# Altium project XbeeReceiver.PrjPcb
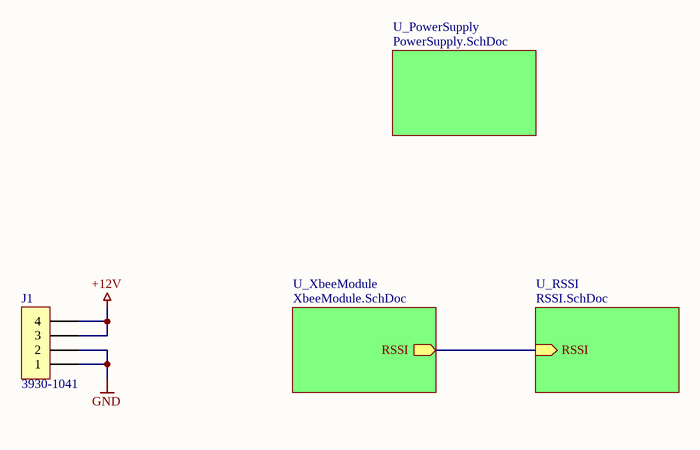
[diagram p0: Main.SchDoc]
4 sheets, 49 parts. Net scope: hierarchical (ports join the sheet entries above them; power ports are global).
Board file: XBeeReceiver.PcbDoc
Sheets:
  Main.SchDoc
    U_PowerSupply = PowerSupply.SchDoc
    U_RSSI = RSSI.SchDoc
    U_XbeeModule = XbeeModule.SchDoc

## Sheet Main.SchDoc
size A

### Parts
J1  3930-1041  [MOLEX-3930-1041]

### Sub-sheets
U_PowerSupply = PowerSupply.SchDoc: no entries
U_RSSI = RSSI.SchDoc: RSSI (in)
U_XbeeModule = XbeeModule.SchDoc: RSSI (out)

### Nets
+12V: J1.3 J1.4
GND: J1.1 J1.2
NetM1_7: sheet U_RSSI/RSSI, sheet U_XbeeModule/RSSI

### Library data of the parts
J1 = Molex-MiniFit-4-RA: Molex MiniFit, Dual Row, Right Angle 3930-1041; Supplier 1: Mouser; Supplier Part Number 1: 538-39-30-1041

## Sheet PowerSupply.SchDoc
size A4
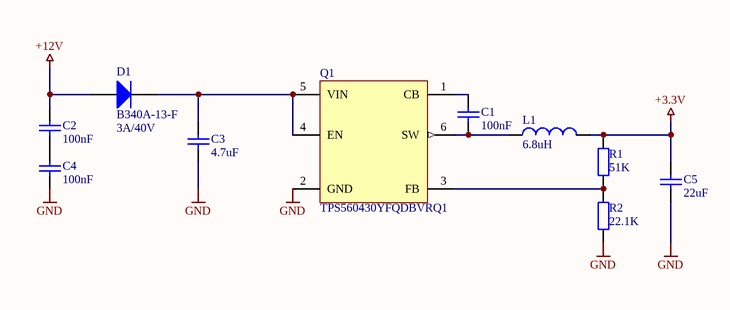
[diagram p1: PowerSupply.SchDoc]

### Parts
C1  value 100nF  [CAPC1608X08N]  (hidden comment: CGA3E2X7R1H104K080AA)
C2  value 100nF  [CAPC1608X08N]  (hidden comment: CGA3E2X7R1H104K080AA)
C3  value 4.7uF  [CAPC2012X14N]  (hidden comment: CGA4J3X5R1H475K125AB)
C4  value 100nF  [CAPC1608X08N]  (hidden comment: CGA3E2X7R1H104K080AA)
C5  value 22uF  [CAPC3225X28N]  (hidden comment: CGA6P1X7R1C226M250AC)
D1  B340A-13-F  value 3A/40V  [DIOM4326X24N]
L1  value 6.8uH  [INDP3532X20N]  (hidden comment: SRP3020TA-6R8M)
Q1  TPS560430YFQDBVRQ1  [SOT95P280X110-6N]
R1  value 51K  [RESC1608X04N]  (hidden comment: ERJ-3EKF5102V)
R2  value 22.1K  [RESC1608X04N]  (hidden comment: ERJ-3EKF2212V)

### Nets
+3.3V: C5.2 L1.2 R1.2
+12V: C2.2 D1.1(A)
GND: C3.1 C4.1 C5.1 Q1.2(GND) R2.1
NetC1_1: C1.1 L1.1 Q1.6(SW)
NetC1_2: C1.2 Q1.1(CB)
NetC2_1: C2.1 C4.2
NetC3_2: C3.2 D1.2(K) Q1.4(EN) Q1.5(VIN)
NetQ1_3: Q1.3(FB) R1.1 R2.2

### Library data of the parts
C1 C2 C4 = C0603-100nF-50V: 0603 Capacitor, 100nF; Supplier 1: Mouser; Supplier Part Number 1: 810-CGA3E2X7R1H104K
C3 = C0805-4.7uF-50V: 0805 Capacitor, 4.7uF; Supplier 1: Mouser; Supplier Part Number 1: 810-CGA4J3X5R1H475K
C5 = C1210-22uF-16V: 1210 Capacitor, 22uF; Supplier 1: Mouser; Supplier Part Number 1: 810-CGA6P1X7R1C226M
D1 = D-SCH-3A-40V: Schottky Diode, 3A, 40A; Supplier 1: Mouser; Supplier Part Number 1: 621-B340A-F
L1 = IND-6.8uH-1.9A: Inductor 6.8uH, 1.9A, 2.2A Isat; Supplier 1: Mouser; Supplier Part Number 1: 652-SRP3020TA-6R8M
Q1 = TPS560430YF: TPS560430-Q1 SIMPLE SWITCHER 4-V to 36-V, 600-mA Synchronous Buck Converter; Supplier 1: Mouser; Supplier Part Number 1: 595-S560430YFQDBVRQ1
R1 = R0603R51K: 0603 Resistor; Supplier 1: Mouser; Supplier Part Number 1: 667-ERJ-3EKF5102V
R2 = R0603R22.1K: 0603 Resistor; Supplier 1: Mouser; Supplier Part Number 1: 667-ERJ-3EKF2212V

## Sheet RSSI.SchDoc
size A4
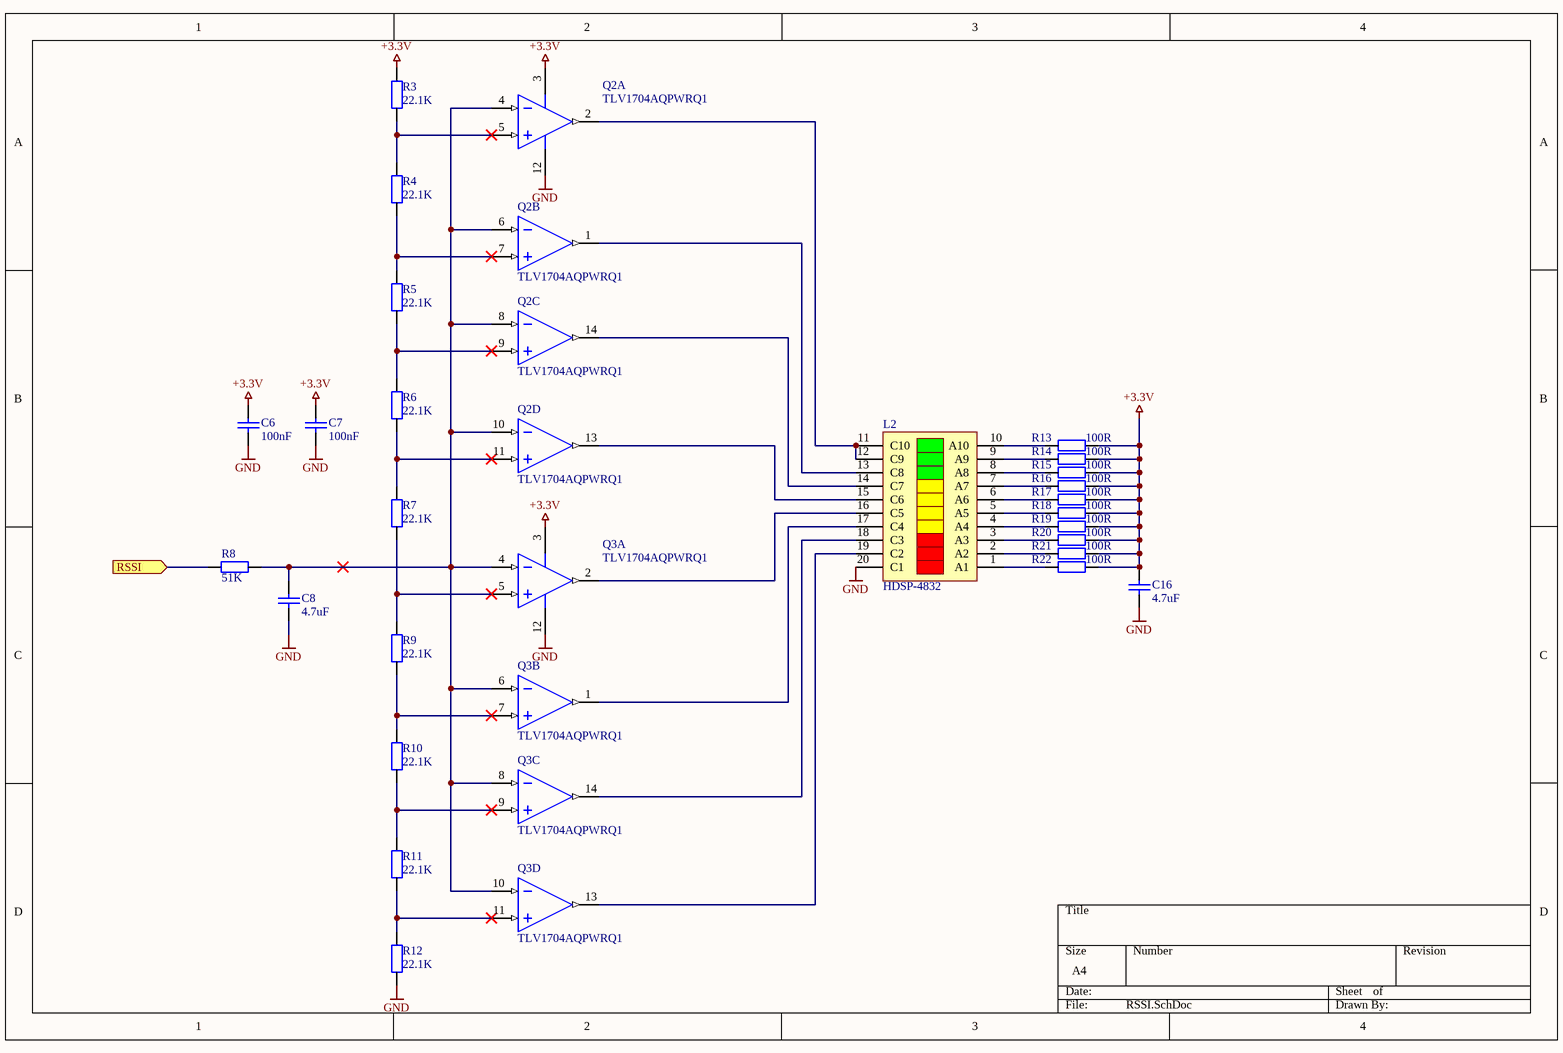
[diagram p2: RSSI.SchDoc]

### Parts
C6  value 100nF  [CAPC1608X08N]  (hidden comment: CGA3E2X7R1H104K080AA)
C7  value 100nF  [CAPC1608X08N]  (hidden comment: CGA3E2X7R1H104K080AA)
C8  value 4.7uF  [CAPC2012X14N]  (hidden comment: CGA4J3X5R1H475K125AB)
C16  value 4.7uF  [CAPC2012X14N]  (hidden comment: CGA4J3X5R1H475K125AB)
L2  HDSP-4832  [HDSP-4832]
Q2  TLV1704AQPWRQ1  [TSOP65P640X120-14N]  (parts A,B,C,D of 4)
Q3  TLV1704AQPWRQ1  [TSOP65P640X120-14N]  (parts A,B,C,D of 4)
R3  value 22.1K  [RESC1608X04N]  (hidden comment: ERJ-3EKF2212V)
R4  value 22.1K  [RESC1608X04N]  (hidden comment: ERJ-3EKF2212V)
R5  value 22.1K  [RESC1608X04N]  (hidden comment: ERJ-3EKF2212V)
R6  value 22.1K  [RESC1608X04N]  (hidden comment: ERJ-3EKF2212V)
R7  value 22.1K  [RESC1608X04N]  (hidden comment: ERJ-3EKF2212V)
R8  value 51K  [RESC1608X04N]  (hidden comment: ERJ-3EKF5102V)
R9  value 22.1K  [RESC1608X04N]  (hidden comment: ERJ-3EKF2212V)
R10  value 22.1K  [RESC1608X04N]  (hidden comment: ERJ-3EKF2212V)
R11  value 22.1K  [RESC1608X04N]  (hidden comment: ERJ-3EKF2212V)
R12  value 22.1K  [RESC1608X04N]  (hidden comment: ERJ-3EKF2212V)
R13  value 100R  [RESC1608X04N]  (hidden comment: ERJ-3EKF1000V)
R14  value 100R  [RESC1608X04N]  (hidden comment: ERJ-3EKF1000V)
R15  value 100R  [RESC1608X04N]  (hidden comment: ERJ-3EKF1000V)
R16  value 100R  [RESC1608X04N]  (hidden comment: ERJ-3EKF1000V)
R17  value 100R  [RESC1608X04N]  (hidden comment: ERJ-3EKF1000V)
R18  value 100R  [RESC1608X04N]  (hidden comment: ERJ-3EKF1000V)
R19  value 100R  [RESC1608X04N]  (hidden comment: ERJ-3EKF1000V)
R20  value 100R  [RESC1608X04N]  (hidden comment: ERJ-3EKF1000V)
R21  value 100R  [RESC1608X04N]  (hidden comment: ERJ-3EKF1000V)
R22  value 100R  [RESC1608X04N]  (hidden comment: ERJ-3EKF1000V)

### Ports
RSSI (in)

### Nets
+3.3V: C6.2 C7.2 C16.2 Q2.3(V+) Q3.3(V+) R3.2 R13.2 R14.2 R15.2 R16.2 R17.2 R18.2 R19.2 R20.2 R21.2 R22.2
GND: C6.1 C7.1 C8.1 C16.1 L2.20(C1) Q2.12(V-) Q3.12(V-) R12.1
NetC8_2: C8.2 Q2.4(IN1-) Q2.6(IN2-) Q2.8(IN3-) Q2.10(IN4-) Q3.4(IN1-) Q3.6(IN2-) Q3.8(IN3-) Q3.10(IN4-) R8.1
NetL2_1: L2.1(A1) R22.1
NetL2_2: L2.2(A2) R21.1
NetL2_3: L2.3(A3) R20.1
NetL2_4: L2.4(A4) R19.1
NetL2_5: L2.5(A5) R18.1
NetL2_6: L2.6(A6) R17.1
NetL2_7: L2.7(A7) R16.1
NetL2_8: L2.8(A8) R15.1
NetL2_9: L2.9(A9) R14.1
NetL2_10: L2.10(A10) R13.1
NetL2_11: L2.11(C10) L2.12(C9) Q2.2(OUT1)
NetL2_13: L2.13(C8) Q2.1(OUT2)
NetL2_14: L2.14(C7) Q2.14(OUT3)
NetL2_15: L2.15(C6) Q2.13(OUT4)
NetL2_16: L2.16(C5) Q3.2(OUT1)
NetL2_17: L2.17(C4) Q3.1(OUT2)
NetL2_18: L2.18(C3) Q3.14(OUT3)
NetL2_19: L2.19(C2) Q3.13(OUT4)
NetM1_7: R8.2 ; port RSSI
NetQ2_5: Q2.5(IN1+) R3.1 R4.2
NetQ2_7: Q2.7(IN2+) R4.1 R5.2
NetQ2_9: Q2.9(IN3+) R5.1 R6.2
NetQ2_11: Q2.11(IN4+) R6.1 R7.2
NetQ3_5: Q3.5(IN1+) R7.1 R9.2
NetQ3_7: Q3.7(IN2+) R9.1 R10.2
NetQ3_9: Q3.9(IN3+) R10.1 R11.2
NetQ3_11: Q3.11(IN4+) R11.1 R12.2

### Library data of the parts
C6 C7 = C0603-100nF-50V: 0603 Capacitor, 100nF; Supplier 1: Mouser; Supplier Part Number 1: 810-CGA3E2X7R1H104K
C8 C16 = C0805-4.7uF-50V: 0805 Capacitor, 4.7uF; Supplier 1: Mouser; Supplier Part Number 1: 810-CGA4J3X5R1H475K
L2 = HDSP-4832: 10-Element Bar Graph Array, Red Yellow Green; Supplier 1: Mouser; Supplier Part Number 1: 630-HDSP-4832
Q2 Q3 = TLV1704Q: TLV1704-Q1 2.2-V to 36-V, microPower Comparator, 4 channels; Published: 8-Jun-2000; LatestRevisionDate: 17-Jul-2002; LatestRevisionNote: Re-released for DXP Platform.; DatasheetVersion: REV. B; PackageVersion: 1990; PackageReference: H-08A; Publisher: Altium Limited; PackageDescription: Can; 8 Leads; Pin Circle Dia. 5.08 mm; Lead Dia. 0.53 mm (max); ComponentLink1Description: Manufacturer Link; ComponentLink1URL: http://www.analog.com/; Supplier 1: Mouser; Supplier Part Number 1: 595-TLV1704AQPWRQ1
R3-R7 R9-R12 = R0603R22.1K: 0603 Resistor; Supplier 1: Mouser; Supplier Part Number 1: 667-ERJ-3EKF2212V
R8 = R0603R51K: 0603 Resistor; Supplier 1: Mouser; Supplier Part Number 1: 667-ERJ-3EKF5102V
R13-R22 = R0603R100: 0603 Resistor; Supplier 1: Mouser; Supplier Part Number 1: 667-ERJ-3EKF1000V

## Sheet XbeeModule.SchDoc
size A4
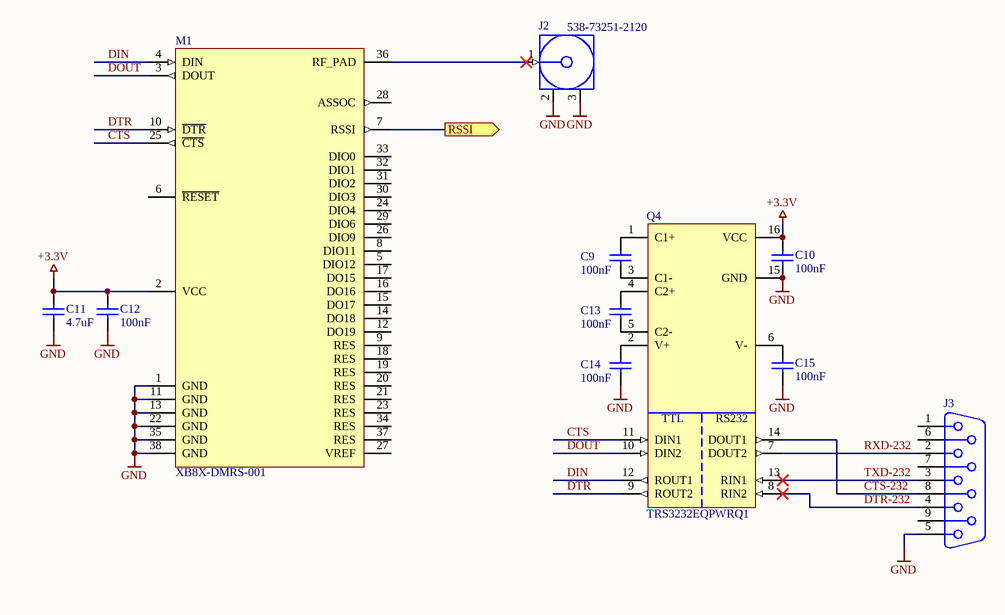
[diagram p3: XbeeModule.SchDoc]

### Parts
C9  value 100nF  [CAPC1608X08N]  (hidden comment: CGA3E2X7R1H104K080AA)
C10  value 100nF  [CAPC1608X08N]  (hidden comment: CGA3E2X7R1H104K080AA)
C11  value 4.7uF  [CAPC2012X14N]  (hidden comment: CGA4J3X5R1H475K125AB)
C12  value 100nF  [CAPC1608X08N]  (hidden comment: CGA3E2X7R1H104K080AA)
C13  value 100nF  [CAPC1608X08N]  (hidden comment: CGA3E2X7R1H104K080AA)
C14  value 100nF  [CAPC1608X08N]  (hidden comment: CGA3E2X7R1H104K080AA)
C15  value 100nF  [CAPC1608X08N]  (hidden comment: CGA3E2X7R1H104K080AA)
J2  Supplier Part Number 1: 538-73251-2120  [MOLEX-SMA-PCB]  (hidden comment: 73251-2120)
J3  DB9 - 2311765-2  [DB9F-PCB-TH]  (value not drawn)
M1  XB8X-DMRS-001  [XBEESX868MOD]
Q4  TRS3232EQPWRQ1  [TSOP65P640X120-16N]

### Ports
RSSI (out)

### Nets
+3.3V: C10.1 C11.2 C12.1 M1.2(VCC) Q4.16(VCC)
GND: C10.2 C11.1 C12.2 C14.2 C15.2 J2.2(GND) J2.3(GND) J3.5 M1.1(GND) M1.11(GND) M1.13(GND) M1.22(GND) M1.35(GND) M1.38(GND) Q4.15(GND)
CTS: M1.25(~{CTS}) Q4.11(DIN1)
CTS-232: J3.8 Q4.14(DOUT1)
DIN: M1.4(DIN) Q4.12(ROUT1)
DOUT: M1.3(DOUT) Q4.10(DIN2)
DTR: M1.10(~{DTR}) Q4.9(ROUT2)
DTR-232: J3.4 Q4.8(RIN2)
RXD-232: J3.2 Q4.7(DOUT2)
TXD-232: J3.3 Q4.13(RIN1)
NetC9_1: C9.1 Q4.1(C1+)
NetC9_2: C9.2 Q4.3(C1-)
NetC13_1: C13.1 Q4.4(C2+)
NetC13_2: C13.2 Q4.5(C2-)
NetC14_1: C14.1 Q4.2(V+)
NetC15_1: C15.1 Q4.6(V-)
NetJ2_1: J2.1(Signal) M1.36(RF_PAD)
NetM1_7: M1.7(RSSI) ; port RSSI

Not connected (* = marked no-connect by the designer): J3 1 6 7 9; M1 5(DIO12) 6(~{RESET}) 8(DIO11) 9(RES) 12(DO19) 14(DO18) 15(DO17) 16(DO16) 17(DO15) 18(RES) 19(RES) 20(RES) 21(RES) 23(RES) 24(DIO4) 26(DIO9) 27(VREF) 28(ASSOC) 29(DIO6) 30(DIO3) 31(DIO2) 32(DIO1) 33(DIO0) 34(RES) 37(RES)

### Notes on the sheet
- (in symbol TRS3232EQ1) TTL; RS232

### Library data of the parts
C9 C10 C12-C15 = C0603-100nF-50V: 0603 Capacitor, 100nF; Supplier 1: Mouser; Supplier Part Number 1: 810-CGA3E2X7R1H104K
C11 = C0805-4.7uF-50V: 0805 Capacitor, 4.7uF; Supplier 1: Mouser; Supplier Part Number 1: 810-CGA4J3X5R1H475K
J2 = SMA-PCB: RF Coaxial PCB Connector, 50 Ohms, SMA Jack, Edge Mount; PCB_Layout: Complies with manufacturer's recommendation.; DrillSize: Corresponds to nominal value.; Published: 15-Jul-2004; LatestRevisionDate: 15-Jul-2004; LatestRevisionNote: Component Replaced.; DatasheetDocument: 30-May-2003; PackageDocument: 04-Jul-1999; PackageReference: 919-119J-51AX; Publisher: Altium Limited; ComponentLink1Description: Manufacturer Link; ComponentLink1URL: http://www.amphenolrf.com/; Supplier 1: Mouser
J3 = DB9F-PCB: DB9, Female, PCB, TH; PackageDocument: O; Positions: 9; Gender: Receptacle; Published: 15-Jun-2001; LatestRevisionDate: 17-Jul-2002; LatestRevisionNote: Re-released for DXP Platform.; DatasheetDocument: 1-Sep-1999; PackageReference: 788750; Publisher: Altium Limited; Orientation: Right Angle; Supplier 1: Mouser; Supplier Part Number 1: 571-2311765-2
M1 = XBee-SX-868-RFPad: 868 MHz RF module; Supplier 1: Mouser; Supplier Part Number 1: 888-XB8X-DMRS-001
Q4 = TRS3232EQ1: 3-V TO 5.5-V MULTICHANNEL RS-232 LINE DRIVER/RECEIVER WITH ±15-kV IEC ESD PROTECTION; Supplier 1: Mouser; Supplier Part Number 1: 595-TRS3232EQPWRQ1

## Nets that join several sheets
+3.3V: PowerSupply (C5.2 L1.2 R1.2), RSSI (16 pins), XbeeModule (5 pins)
+12V: Main (J1.3 J1.4), PowerSupply (C2.2 D1.1)
GND: Main (J1.1 J1.2), PowerSupply (5 pins), RSSI (8 pins), XbeeModule (15 pins)
NetM1_7: RSSI (R8.2), XbeeModule (M1.7)